# EAGLE schematic BluetoothBoard-0BAC0702 (EAGLE 5.10)
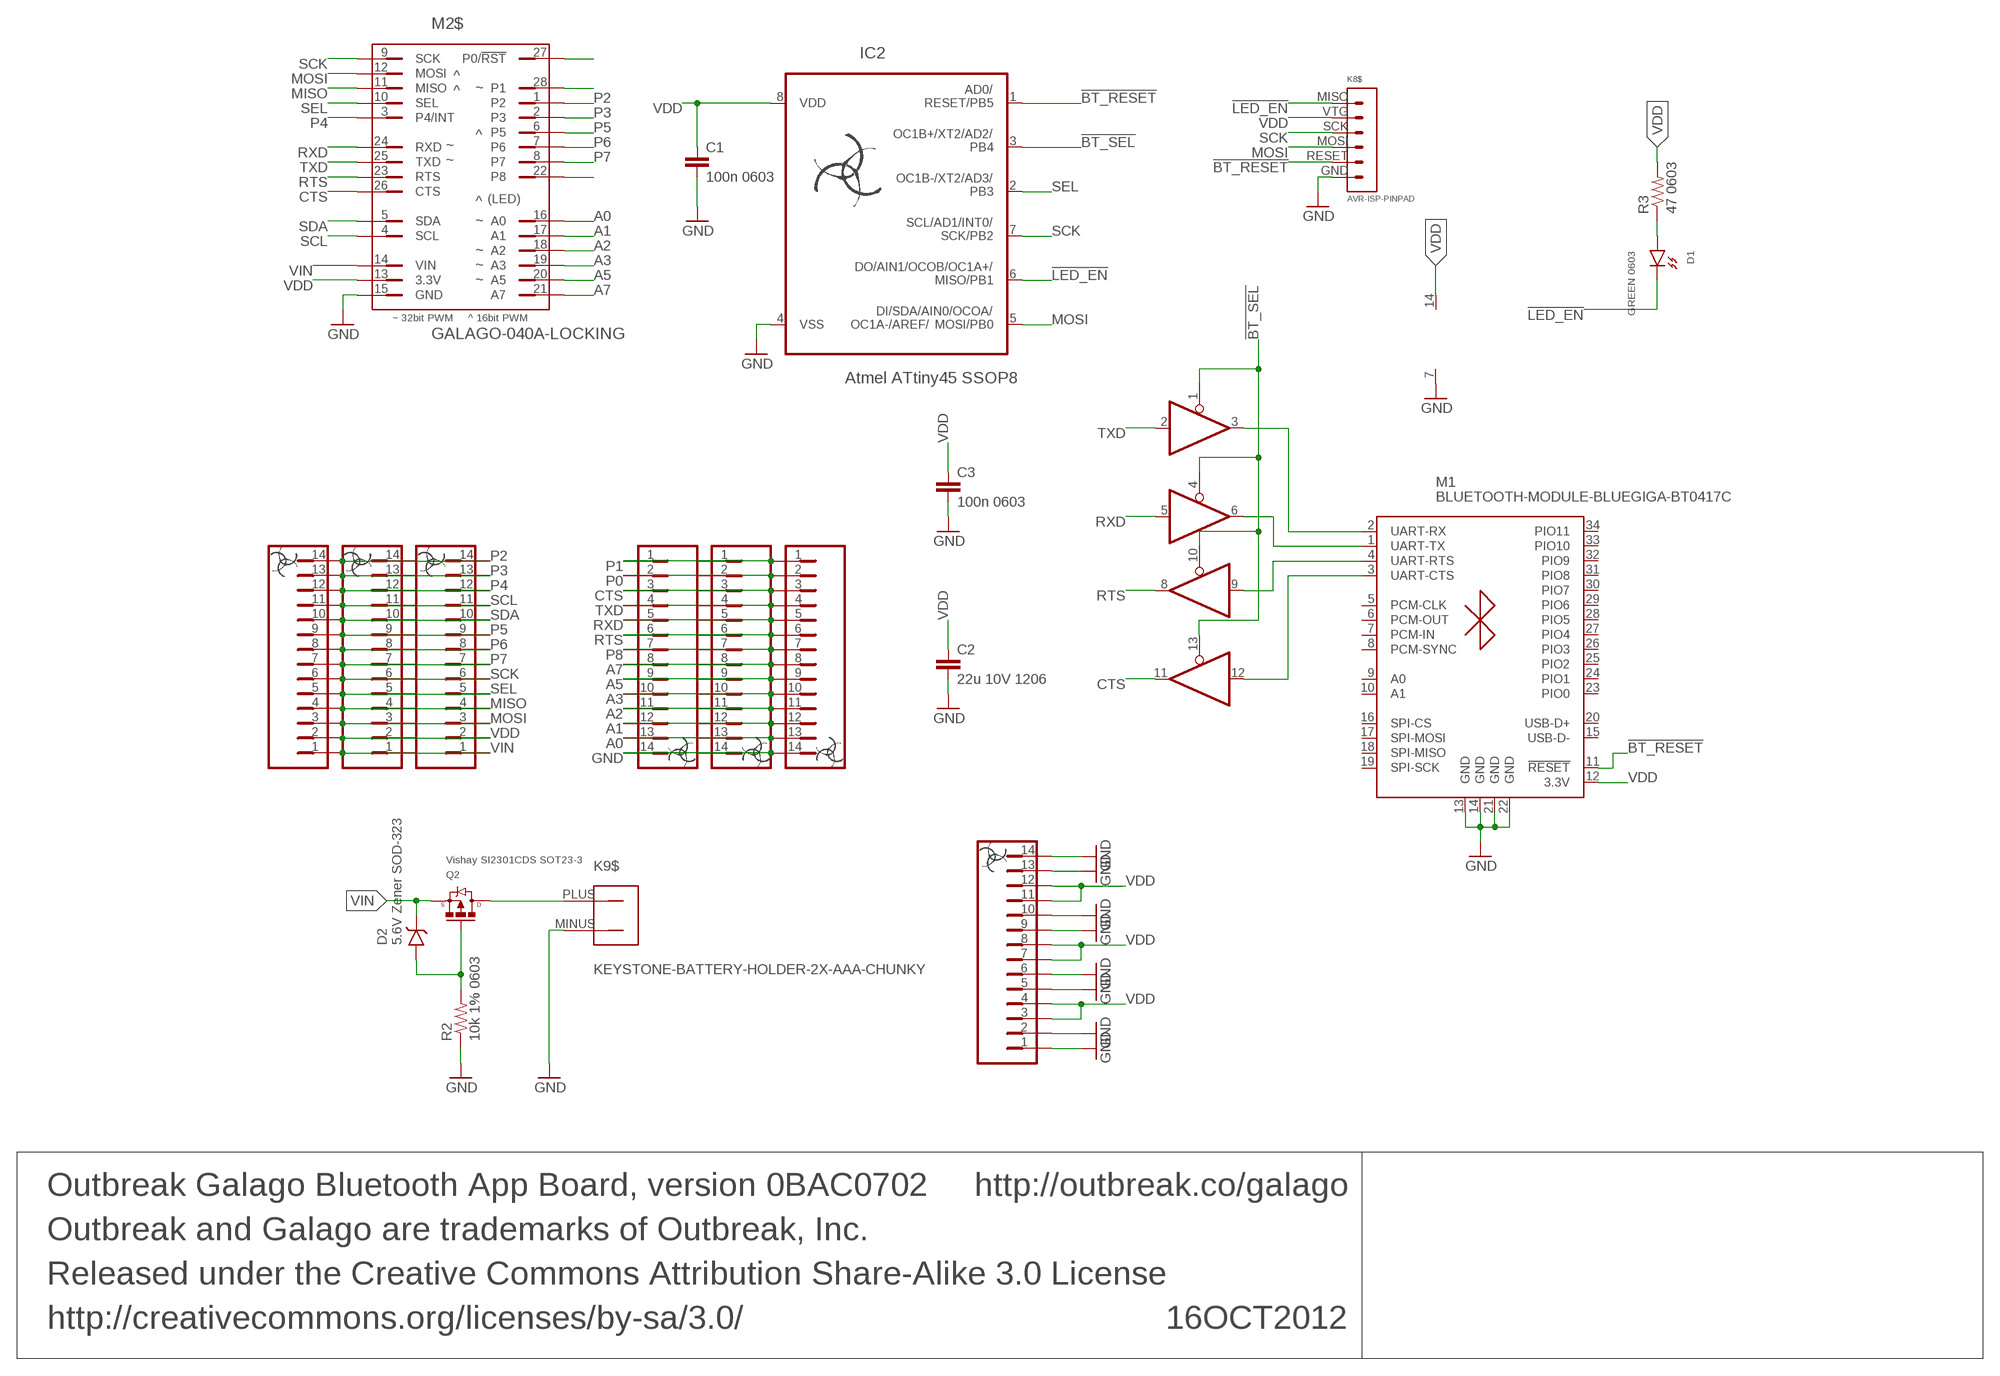
[diagram p0: schematic, sheet 1]

## Parts
16OCT2012  Outbreak Galago Bluetooth App Board, version 0BAC0702  INFO-BLOCK  [INFO-BLOCK]
C1  100n 0603  CAP-0603  [0603]
C2  22u 10V 1206  CAP-1206  [1206]
C3  100n 0603  CAP-0603  [0603]
D1  GREEN 0603  LED-0603  [0603-DIODE]
D2  5.6V Zener SOD-323  DIODE-ZENER-SOD323  [SOD-323]
IC1  74HC125-TSSOP14  [TSSOP14]
IC2  Atmel ATtiny45 SSOP8  AVR-ATTINY25/45/85-TSSOP8  [TSSOP8]
K1$  HEADER-1X14-NO-SILK-CHUNKY  [HEADER-1X14-NO-SILK-CHUNKY]
K2$  HEADER-1X14-NO-SILK-CHUNKY  [HEADER-1X14-NO-SILK-CHUNKY]
K3$  HEADER-1X14-NO-SILK-CHUNKY  [HEADER-1X14-NO-SILK-CHUNKY]
K4$  HEADER-1X14-NO-SILK-CHUNKY  [HEADER-1X14-NO-SILK-CHUNKY]
K5$  HEADER-1X14-NO-SILK-CHUNKY  [HEADER-1X14-NO-SILK-CHUNKY]
K6$  HEADER-1X14-NO-SILK-CHUNKY  [HEADER-1X14-NO-SILK-CHUNKY]
K7$  HEADER-1X14-NO-SILK-CHUNKY  [HEADER-1X14-NO-SILK-CHUNKY]
K8$  AVR-ISP-PINPAD  [AVR-ISP-PINPAD]
K9$  KEYSTONE-BATTERY-HOLDER-2X-AAA-CHUNKY  [KEYSTONE-BATTERY-HOLDER-2X-AAA-CHUNKY]
M1  BLUETOOTH-MODULE-BLUEGIGA-BT0417C  [BLUETOOTH-MODULE-BLUEGIGA-BT0417C]
M2$  GALAGO-040A-LOCKING  [GALAGO-LOCKING]
Q2  Vishay SI2301CDS SOT23-3  MOSFET-P-CHANNEL-VISHAY-SI2301  [SOT23-3]
R2  10k 1% 0603  RESISTOR-0603  [0603]
R3  47 0603  RESISTOR-0603  [0603]

## Nets
!BT_RESET: IC2.1(RESET/PB5) K8$.RESET M1.11(!RESET)
!BT_SEL: IC1.1(EN) IC1.4(EN) IC1.10(EN) IC1.13(EN) IC2.3(PB4)
!LED_EN: D1.2(K) IC2.6(MISO/PB1) K8$.MISO
A0: K4$.13 K5$.13 K6$.13 M2$.16(A0)
A1: K4$.12 K5$.12 K6$.12 M2$.17(A1)
A2: K4$.11 K5$.11 K6$.11 M2$.18(A2)
A3: K4$.10 K5$.10 K6$.10 M2$.19(A3)
A5: K4$.9 K5$.9 K6$.9 M2$.20(A5)
A7: K4$.8 K5$.8 K6$.8 M2$.21(A7)
BATT: K9$.PLUS Q2.3(DRAIN)
CTS: IC1.11(Y) K4$.3 K5$.3 K6$.3 M2$.26(CTS)
GND: C1.1 C2.1 C3.1 IC1.7(VSS) IC2.4(VSS) K4$.14 K5$.14 K6$.14 K7$.1 K7$.2 K7$.5 K7$.6 K7$.9 K7$.10 K7$.13 K7$.14 K8$.GND K9$.MINUS M1.13(GND) M1.14(GND) M1.21(GND) M1.22(GND) M2$.15(GND) R2.1
MISO: K1$.4 K2$.4 K3$.4 M2$.11(MISO)
MOSI: IC2.5(MOSI/PB0) K1$.3 K2$.3 K3$.3 K8$.MOSI M2$.12(MOSI)
N$1: IC1.12(A) M1.3(UART-CTS)
N$2: IC1.9(A) M1.4(UART-RTS)
N$3: IC1.6(Y) M1.1(UART-TX)
N$4: IC1.3(Y) M1.2(UART-RX)
N$6: D2.A Q2.1(GATE) R2.2
N$15: D1.1(A) R3.1
P0: K4$.2 K5$.2 K6$.2 M2$.27(P0/!RST)
P1: K4$.1 K5$.1 K6$.1 M2$.28(P1)
P2: K1$.14 K2$.14 K3$.14 M2$.1(P2)
P3: K1$.13 K2$.13 K3$.13 M2$.2(P3)
P4: K1$.12 K2$.12 K3$.12 M2$.3(P4/INT)
P5: K1$.9 K2$.9 K3$.9 M2$.6(P5)
P6: K1$.8 K2$.8 K3$.8 M2$.7(P6)
P7: K1$.7 K2$.7 K3$.7 M2$.8(P7)
P8: K4$.7 K5$.7 K6$.7 M2$.22(P8)
RTS: IC1.8(Y) K4$.6 K5$.6 K6$.6 M2$.23(RTS)
RXD: IC1.5(A) K4$.5 K5$.5 K6$.5 M2$.24(RXD)
SCK: IC2.7(SCK/PB2) K1$.6 K2$.6 K3$.6 K8$.SCK M2$.9(SCK)
SCL: K1$.11 K2$.11 K3$.11 M2$.4(SCL)
SDA: K1$.10 K2$.10 K3$.10 M2$.5(SDA)
SEL: IC2.2(PB3) K1$.5 K2$.5 K3$.5 M2$.10(SEL)
TXD: IC1.2(A) K4$.4 K5$.4 K6$.4 M2$.25(TXD)
VDD: C1.2 C2.2 C3.2 IC1.14(VDD) IC2.8(VDD) K1$.2 K2$.2 K3$.2 K7$.3 K7$.4 K7$.7 K7$.8 K7$.11 K7$.12 K8$.VTG M1.12(3.3V) M2$.13(3.3V) R3.2
VIN: D2.K K1$.1 K2$.1 K3$.1 M2$.14(VIN) Q2.2(SOURCE)
Unconnected: M1.5(PCM-CLK) M1.6(PCM-OUT) M1.7(PCM-IN) M1.8(PCM-SYNC) M1.9(A0) M1.10(A1) M1.15(USB-D-) M1.16(SPI-CS) M1.17(SPI-MOSI) M1.18(SPI-MISO) M1.19(SPI-SCK) M1.20(USB-D+) M1.23(PIO0) M1.24(PIO1) M1.25(PIO2) M1.26(PIO3) M1.27(PIO4) M1.28(PIO5) M1.29(PIO6) M1.30(PIO7) M1.31(PIO8) M1.32(PIO9) M1.33(PIO10) M1.34(PIO11)

## Library data of the parts
16OCT2012 = Outbreak:INFO-BLOCK
C1-C3 = Outbreak:CAP
D1 = Outbreak:LED
D2 = Outbreak:DIODE-ZENER
IC1 = Outbreak:74HC125
IC2 = Outbreak:AVR-ATTINY25/45/85
K1$ K2$ K3$ K4$ K5$ K6$ K7$ = Outbreak:HEADER-1X14-NO-SILK
K8$ = Outbreak:AVR-ISP-PINPAD
K9$ = Outbreak:KEYSTONE-BATTERY-HOLDER
M1 = Outbreak:BLUETOOTH-MODULE-BLUEGIGA-BT0417C
M2$ = Outbreak-v0:GALAGO-040A
Q2 = Outbreak:MOSFET-P-CHANNEL
R2 R3 = Outbreak:RESISTOR: Resistor Basic schematic elements and footprints for 0603, 1206, and PTH resistors.